# EAGLE design Jacdac_Pressure_Sensor-RevA (EAGLE 9.6.2)
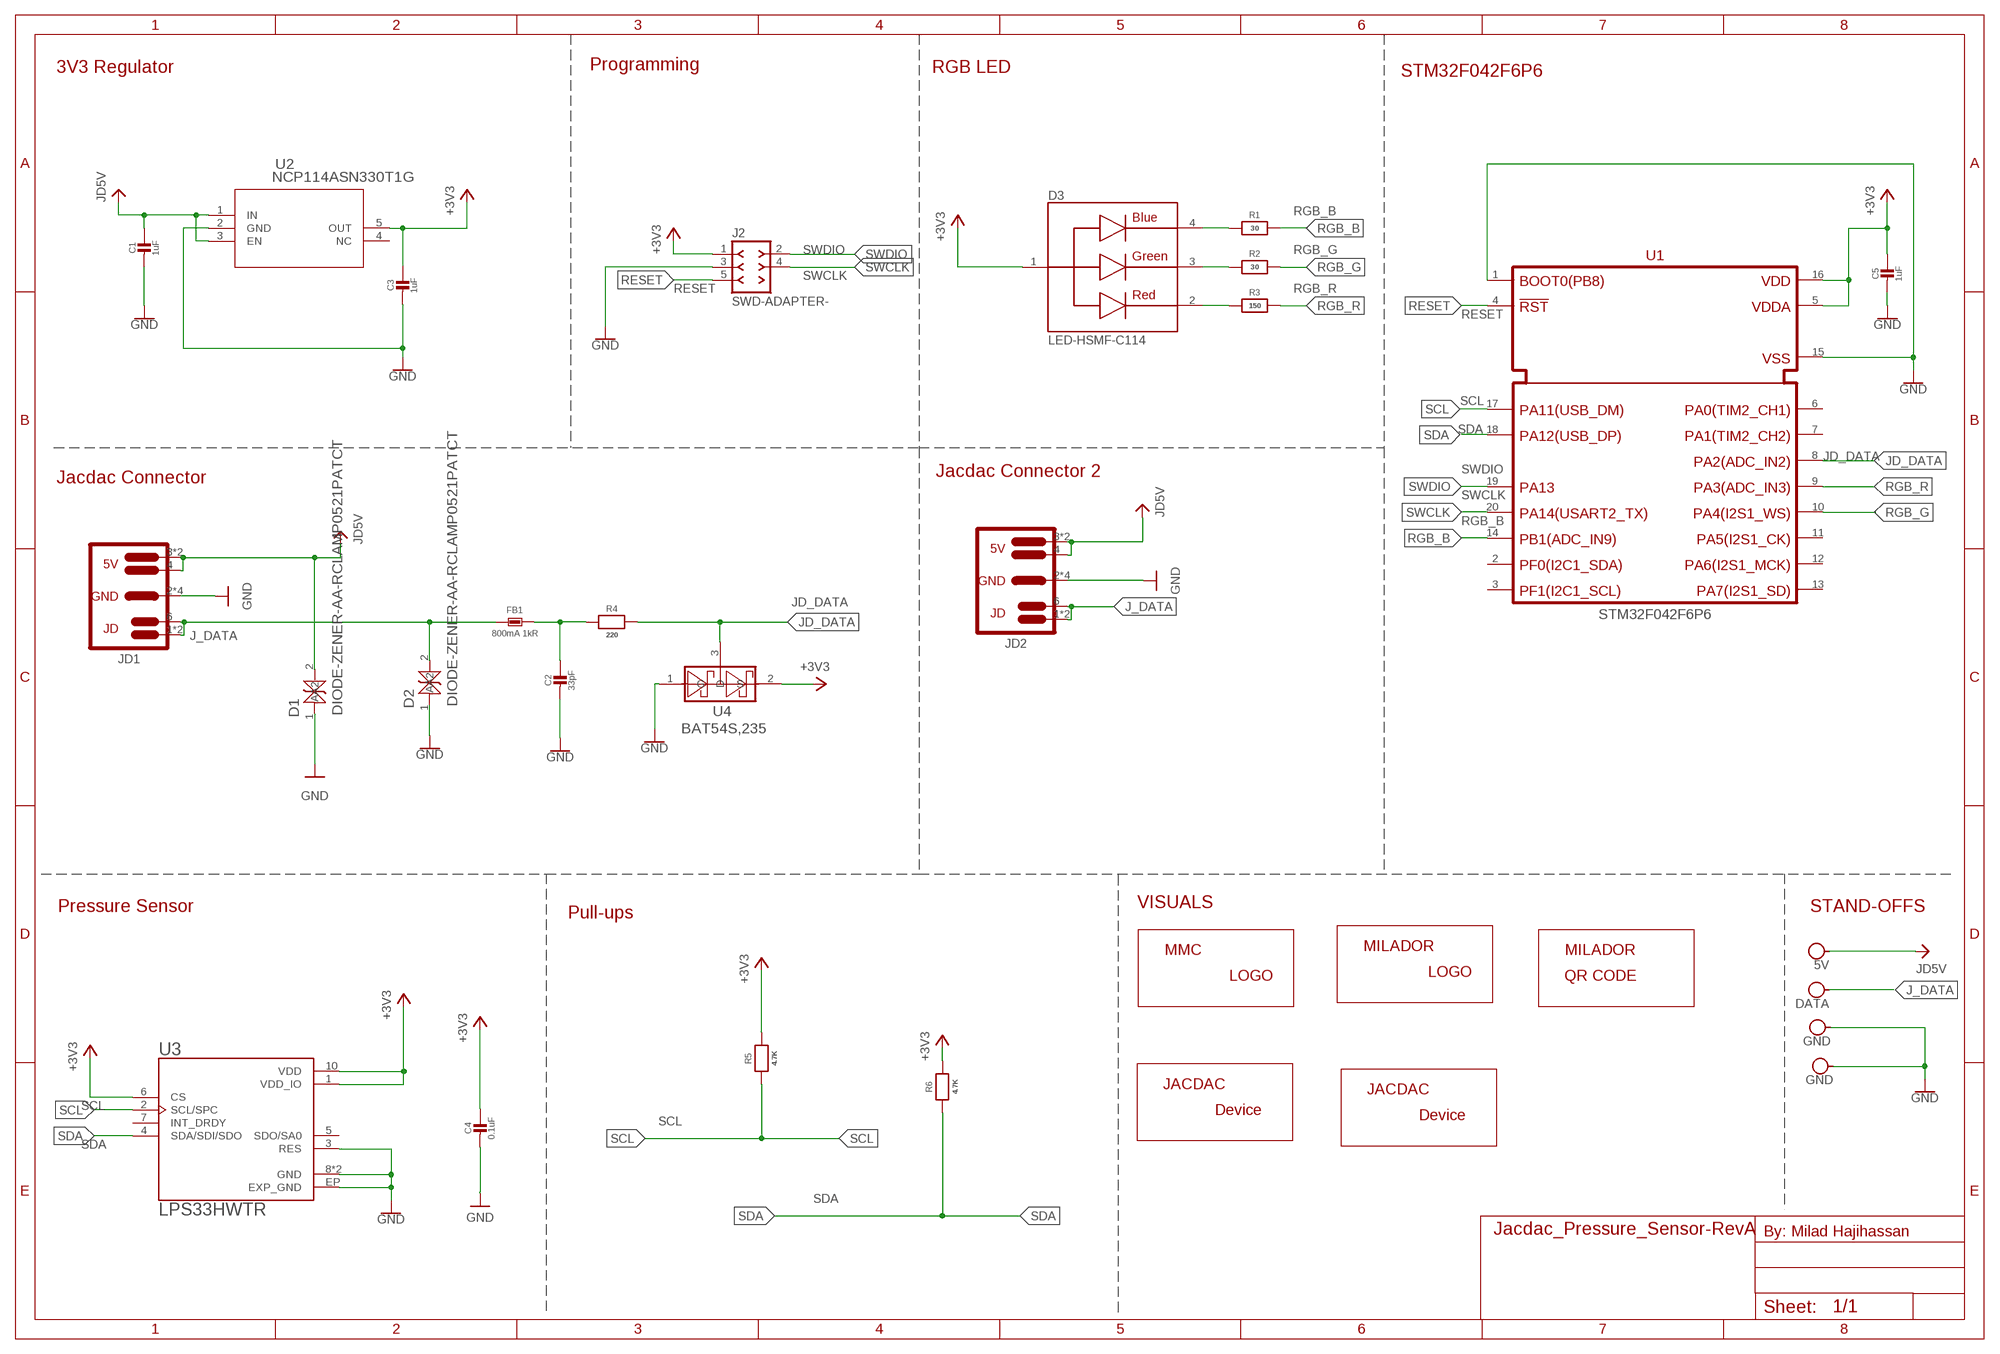
[diagram p0: schematic, sheet 1]

## Parts
C1  1uF  CAP_CERAMIC-0603-NO  [0603-NO]
C2  33pF  CAP_CERAMIC-0603  [0603]
C3  1uF  CAP_CERAMIC-0603-NO  [0603-NO]
C4  0.1uF  CAP_CERAMIC-0603-NO  [0603-NO]
C5  1uF  CAP_CERAMIC-0603  [0603]
D1  DIODE-ZENER-AA-RCLAMP0521PATCT  [DIODE-ZENER-0402]
D2  DIODE-ZENER-AA-RCLAMP0521PATCT  [DIODE-ZENER-0402]
D3  LED-HSMF-C114  [DIOSC160X150X35-4N]
FB1  800mA 1kR  FERRITE-BEAD-0603-NO  [0603-NO]
J2  SWD-ADAPTER-  [SWD-ADAPTER]
J3  5V  JACDAC-M3-PWR-OUTL  [M3-HOLE-PWR-OUTL]
J4  DATA  JACDAC-M3-DATA-NOTCH  [M3-HOLE-DATA-NOTCH]
J5  GND  JACDAC-M3-GND  [M3-HOLE-GND]
J6  GND  JACDAC-M3-GND  [M3-HOLE-GND]
JD1  JACDAC-EDGE-OUTIE  [JD-EDGE-OUTIE]
JD2  JACDAC-EDGE-OUTIE  [JD-EDGE-OUTIE]
LABEL_JACDAC_PS  MILADOR-JACDAC-DEVICE-PS  [JACDAC-PRESSURE-SENSOR]
LABEL_LPS33HW  MILADOR-JACDAC-DEVICE-LPS33HW  [JACDAC-LPS33HW]
LABEL_MILADOR  MILADOR-LOGO-  [MILADOR_LOGO1]
LABEL_QR_CODE  MILADOR-QR-CODE-JACDAC-GITHUB-PS  [MILADOR_QR_JACDAC_PS]
MMC_LOGO  MMC_LOGO-XSM  [MMC_X-SMALL_LOGO]
R1  30  RESISTOR-0603  [0603]
R2  30  RESISTOR-0603  [0603]
R3  150  RESISTOR-0603  [0603]
R4  220  RESISTOR-0603  [0603]
R5  4.7K  RESISTOR-0603  [0603]
R6  4.7K  RESISTOR-0603  [0603]
U1  STM32F042F6P6  [TSSOP20]
U2  NCP114ASN330T1G  [TSOP-5_ONS]
U3  LPS33HWTR  [PQFN60P330X330X290-11N]
U4  BAT54S,235  [SOT23-3]

## Nets
+3V3: C3.1 C4.1 C5.1 D3.1 J2.1(VCC_1) R5.2 R6.2 U1.5(VDDA) U1.16(VDD) U2.5(OUT) U3.1(VDD_IO) U3.6(CS) U3.10(VDD) U4.2(S)
GND: C1.2 C2.2 C3.2 C4.2 C5.2 D1.1(A) D2.1(A) J2.3(GND_3) J5.H J6.H JD1.2 JD1.5 JD1.P$2 JD1.P$4 JD2.2 JD2.5 JD2.P$2 JD2.P$4 U1.1(BOOT0) U1.15(VSS) U2.2(GND) U3.3(RES) U3.8(GND) U3.9(GND) U3.EP(EXP_GND) U4.1(G)
J_DATA: D2.2(A2) FB1.2 J4.H JD1.1 JD1.6 JD1.P$3 JD2.1 JD2.6 JD2.P$3
JD5V: C1.1 D1.2(A2) J3.H JD1.3 JD1.4 JD1.P$1 JD2.3 JD2.4 JD2.P$1 U2.1(IN) U2.3(EN)
JD_DATA: R4.2 U1.8(PA2) U4.3(D)
N$1: D3.4 R1.1
N$2: D3.3 R2.1
N$3: D3.2 R3.1
N$4: C2.1 FB1.1 R4.1
RESET: J2.5(RESET_5) U1.4(!RST)
RGB_B: R1.2 U1.14(PB1)
RGB_G: R2.2 U1.10(PA4)
RGB_R: R3.2 U1.9(PA3)
SCL: R5.1 U1.17(PA11) U3.2(SCL/SPC)
SDA: R6.1 U1.18(PA12) U3.4(SDA/SDI/SDO)
SWCLK: J2.4(SWCLK_4) U1.20(PA14)
SWDIO: J2.2(SWDIO_2) U1.19(PA13)
Unconnected: U1.2(PF0) U1.3(PF1) U1.6(PA0) U1.7(PA1) U1.11(PA5) U1.12(PA6) U1.13(PA7) U2.4(NC) U3.5(SDO/SA0) U3.7(INT_DRDY)

## Notes on the sheet
- 3V3 Regulator | Programming | RGB LED
- STM32F042F6P6
- Jacdac Connector 2
- Jacdac Connector
- Pressure Sensor | VISUALS | STAND-OFFS
- Pull-ups
- By: Milad Hajihassan

## Library data of the parts
C1-C5 = milador_SMD:CAP_CERAMIC-: Ceramic Capacitors For new designs, use the packages preceded by an '_' character since they are more reliable: The following footprints should be used on most boards: _0402 - Standard footprint for regular board layouts _0603 - Standard footprint for regular board layouts _0805 - Standard footprint for regular board layouts _1206 - Standard footprint for regular board layouts For extremely tight-pitch boards where space is at a premium, the following 'micro-pitch' footprints can be used (smaller pads, no silkscreen outline, etc.): _0402MP - Micro-pitch footprint for very dense/compact boards _0603MP - Micro-pitch footprint for very dense/compact boards _0805MP - Micro-pitch footprint for very dense/compact boards _1206MP - Micro-pitch footprint for very dense/compact boards
D1 D2 = milador_SMD:DIODE-ZENER-AA-; COPYRIGHT: Copyright (C) 2021 Ultra Librarian. All rights reserved.; DIGI-KEY_PART_NUMBER_1: RCLAMP0521PACT-ND; DIGI-KEY_PART_NUMBER_2: RCLAMP0521PADKR-ND; DIGI-KEY_PART_NUMBER_3: RCLAMP0521PATR-ND; MANUFACTURER_PART_NUMBER: RCLAMP0521PATCT; MFR_NAME: Semtech
D3 = milador_SMD:LED-HSMF-C114: LED Tri-Color Blue/Green/Red 468nm/523nm/637nm 4-Pin Chip LED T/R Check prices <https://pricing.snapeda.com/parts/HSMF-C114/Broadcom%20Limited/view-part?ref=eda>; DESCRIPTION: Red, Green, Blue (RGB) 626nm Red, 525nm Green, 470nm Blue LED Indication - Discrete 1.9V Red, 3.4V Green, 3.4V Blue 0606 (1616 Metric); MF: Broadcom Limited; MP: HSMF-C114; PACKAGE: 0606 Avago; PRICE: None; PURCHASE-URL: https://pricing.snapeda.com/search/part/HSMF-C114/?ref=eda
FB1 = milador_SMD:FERRITE-BEAD-: Ferrite Beads
J2 = milador:SWD-ADAPTER-
J3-J6 = milador:JACDAC-M3: Jacdac mounting Hole M3
JD1 JD2 = milador:JACDAC-EDGE
LABEL_JACDAC_PS LABEL_LPS33HW = milador:MILADOR-JACDAC-DEVICE-
LABEL_MILADOR = milador:MILADOR-LOGO-
LABEL_QR_CODE = milador:MILADOR-QR-CODE-
MMC_LOGO = MMC Eagle:MMC_LOGO-
R1-R6 = milador_SMD:RESISTOR-: Resistors For new designs, use the packages preceded by an '_' character since they are more reliable: The following footprints should be used on most boards: _0402 - Standard footprint for regular board layouts _0603 - Standard footprint for regular board layouts _0805 - Standard footprint for regular board layouts _1206 - Standard footprint for regular board layouts For extremely tight-pitch boards where space is at a premium, the following 'micro-pitch' footprints can be used (smaller pads, no silkscreen outline, etc.): _0402MP - Micro-pitch footprint for very dense/compact boards _0603MP - Micro-pitch footprint for very dense/compact boards _0805MP - Micro-pitch footprint for very dense/compact boards _1206MP - Micro-pitch footprint for very dense/compact boards
U1 = milador_SMD:STM32F042F6P6; MOUSER: 511-STM32F042F6P6
U2 = milador_SMD:NCP114ASN330T1G; COPYRIGHT: Copyright (C) 2021 Ultra Librarian. All rights reserved.; DIGI-KEY_PART_NUMBER_1: 2156-NCP114ASN330T1G-ND; DIGI-KEY_PART_NUMBER_2: 2156-NCP114ASN330T1G-OS-ND; DIGI-KEY_PART_NUMBER_3: NCP114ASN330T1GOSCT-ND; DIGI-KEY_PART_NUMBER_4: NCP114ASN330T1GOSDKR-ND; DIGI-KEY_PART_NUMBER_5: NCP114ASN330T1GOSTR-ND; MANUFACTURER_PART_NUMBER: NCP114ASN330T1G; MFR_NAME: ON Semiconductor
U3 = milador_SMD:LPS33HWTR: Pressure Sensor; DESCRIPTION: Pressure Sensor 3.77PSI ~ 18.27PSI (26kPa ~ 126kPa) Absolute 24 b LGA; DIGI-KEY_PART_NUMBER: 497-17590-1-ND; MF: STMicroelectronics; MP: LPS33HWTR; PACKAGE: LGA STMicroelectronics
U4 = milador_SMD:BAT54S,235: BAT54S,235 Schottky Diode; DESCRIPTION: N-Channel 50V 200mA (Ta) 300mW (Ta) Surface Mount SOT-23-3; MF: Diodes; MP: BSS138-7-F; PACKAGE: SOT-23-3 Fairchild Semiconductor; PRICE: None; PURCHASE-URL: https://pricing.snapeda.com/search/part/BSS138-7-F/?ref=eda

## Board
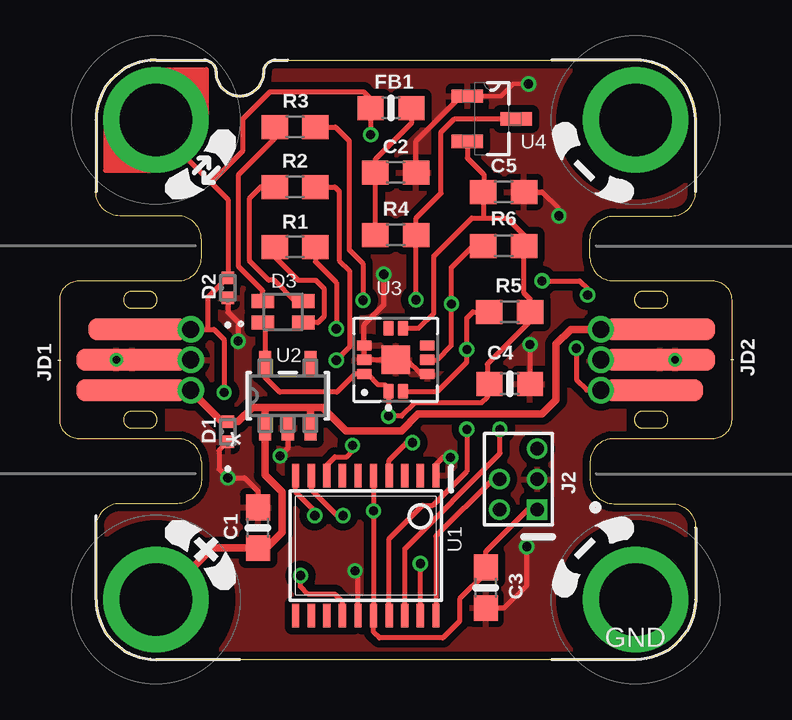
[diagram p1: board, top side]
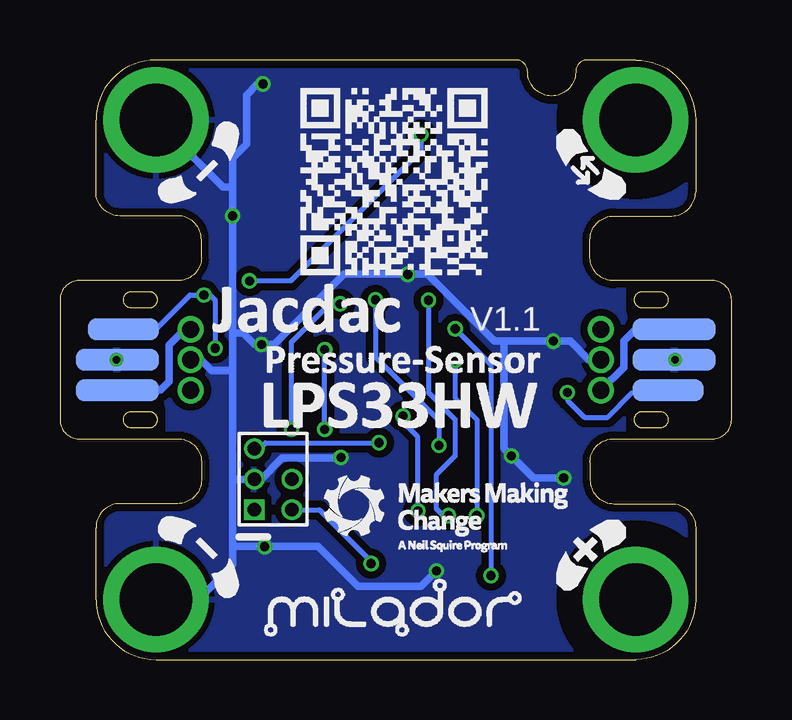
[diagram p2: board, bottom side, seen from below]

Size 28 x 25 mm. Coordinates in mm from the lower left corner, seen from the top.
Outline: 1.5,19.5 1.5,22.5 arc-90 4,25 6,25 arc-90 6.5,24.5 arc90 7.5,23.5 arc90 8.5,24.5 arc-90 9,25 24,25 arc-90 26.5,22.5 26.5,19.5
Outline: 1.5,5.5 1.5,2.5 arc90 4,0 24,0 arc90 26.5,2.5 26.5,5.5
Copper layers (1*16): Top 0.035559375mm / dielectric 1.6mm / Bottom 0.035559375mm
Design rules "SparkFun-2-layer-TIGHT *": minimum track width 5mil, minimum drill 12mil, track to track 5mil, track to pad 5mil, pad to pad 5mil, via to via 5mil, smd to smd 5mil, copper to edge 10mil, drill to drill 8mil, minimum pad ring 5mil, minimum via ring 5mil, stop-mask expansion 2.5mil, vias tented up to drill 30mil, thermal gap 10mil

### Footprints (pad centres in the part's own frame; a part is rotated, then mirrored left to right if it is on the bottom)
0603-NO = smd 1.075 x 1: 1 -0.85,0; 2 0.85,0
0603 = smd 1.1 x 1: 1 -0.85,0; 2 0.85,0
DIODE-ZENER-0402 = smd 0.508 x 0.508: 1 -0.419,0; 2 0.419,0
DIOSC160X150X35-4N = smd 0.94 x 0.57: 1 -0.845,-0.45; 2 -0.845,0.45; 3 0.845,0.45; 4 0.845,-0.45
SWD-ADAPTER = drill 0.559 pad 0.864 square: 1 0,0 | drill 0.559 pad 0.864: 2 0,1.575; 3 1.27,0; 4 1.27,1.575; 5 2.54,0
M3-HOLE-PWR-OUTL = drill 3.03 pad 4.4: H 0,0
M3-HOLE-DATA-NOTCH = drill 3.03 pad 4.4: H 0,0
M3-HOLE-GND = drill 3.03 pad 4.4: H 0,0
JD-EDGE-OUTIE = smd 0.9 x 4.1: 1 1.27,-3.25 | smd 0.9 x 4.6: 2 0,-3; 3 -1.27,-3 | smd 0.9 x 3.45 bottom: 4 1.27,-2.4; 5 0,-2.4 | smd 0.9 x 2.95 bottom: 6 -1.27,-2.65 | drill 0.71 pad 1.1: P$1 -1.27,-5.45; P$2 0,-5.45; P$3 1.27,-5.45 | drill 0.305 pad 0.559: P$4 0,-2.35
TSSOP20 = smd 0.305 x 0.991: 1 -2.925,-2.918; 2 -2.275,-2.918; 3 -1.625,-2.918; 4 -0.975,-2.918; 5 -0.325,-2.918; 6 0.325,-2.918; 7 0.975,-2.918; 8 1.625,-2.918; 9 2.275,-2.918; 10 2.925,-2.918; 11 2.925,2.918; 12 2.275,2.918; 13 1.625,2.918; 14 0.975,2.918; 15 0.325,2.918; 16 -0.325,2.918; 17 -0.975,2.918; 18 -1.625,2.918; 19 -2.275,2.918; 20 -2.925,2.918
TSOP-5_ONS = smd 1.029 x 0.508: 1 -1.34,0.95; 2 -1.34,0; 3 -1.34,-0.95; 4 1.34,-0.95; 5 1.34,0.95
PQFN60P330X330X290-11N = smd 0.63 x 0.45: 1 -1.32,0.3; 2 -1.32,-0.3; 6 1.32,-0.3; 7 1.32,0.3 | smd 0.45 x 0.63: 3 -0.6,-1.32; 4 0,-1.32; 5 0.6,-1.32; 8 0.6,1.32; 9 0,1.32; 10 -0.6,1.32 | smd 1.2 x 1.2: EP 0,0
SOT23-3 = smd 1.321 x 0.559: 1 -1.016,0.94; 2 -1.016,-0.94; 3 1.016,0

### Placement (x,y rotation side)
C1  8.25,5.5 90 top
C2  14,20.3 0 top
C3  17.75,3 270 top
C4  18.75,11.5 0 top
C5  18.5,19.5 0 top
D1  7,9.5 90 top
D2  7,15.5 90 top
D3  9.3,14.5 0 top
FB1  13.8,23 180 top
J2  19.9,6.25 90 top
J3  4,2.5 0 top
J4  4,22.5 0 top
J5  24,22.5 90 top
J6  24,2.5 0 top
JD1  0,12.5 90 top
JD2  28,12.5 270 top
LABEL_JACDAC_PS  14.8,13.8 0 bottom
LABEL_LPS33HW  13.8,10.6 0 bottom
LABEL_MILADOR  14,1 0 bottom
LABEL_QR_CODE  14,16 0 bottom
MMC_LOGO  12,4.5 0 bottom
R1  9.8,17.2 0 top
R2  9.8,19.7 0 top
R3  9.8,22.2 0 top
R4  14,17.7 0 top
R5  18.75,14.5 0 top
R6  18.5,17.25 0 top
U1  12.75,4.75 180 top
U2  9.5,11 90 top
U3  14,12.5 90 top
U4  18,22.55 0 top

### Tracks (layer width: path | path; a pad name or v marks a point on that pad's centre or on a via)
+3V3  (via drill 0.38)
  Top 0.2: U4.2 16.98,20.91 17.68,20.22 17.68,19.53 C5.1 17.65,18.41 | J2.1 19.49,6.25 17.75,4.51 C3.1 17.75,3.61 16.67,2.52 16.67,1.6 15.97,0.9 13.32,0.9 13.07,1.14 U1.16 v13.08,6.2 v13.07,6.2 U1.5 | C4.1 17.82,11.5 | D3.1 8.46,13.93 8.55,13.83 U2.5 8.55,11.77 9.16,11.16 11.55,11.16 12.3,11.9 U3.10 12.84,11.9 13.28,11.45 13.55,11.45 13.7,11.3 U3.1 v13.7,10.15 14.24,10.15 14.79,10.7 17.58,10.7 17.82,10.94 17.82,11.5 | 17.82,11.5 17.82,12.31 19.6,14.1 R5.2 19.6,15.04 19.35,15.29 R6.2 19.35,17.69 18.63,18.41 17.65,18.41 | U3.6 14.96,13.82 15.59,14.45 15.59,16.82 17.17,18.41 17.65,18.41
  Bottom 0.2: v13.7,10.15 13.7,9.9 13.08,9.28 v13.08,6.2
GND  (via drill 0.38)
  Top 0.178: U4.1 18.38,23.49 18.9,24 v19.54,24
  Top 0.2: U1.1 15.68,8.14 15.96,8.43 v16.29,8.43 | v19.6,13.14 C4.2 | 12.68,12.51 U3.8 12.68,13.98 13.5,14.8 v13.5,16.06 | 12.68,12.51 U3.9 | U3.3 15.04,11.9 14.44,12.5 U3.EP 12.69,12.5 12.68,12.51 | U2.2 9.5,8.81 v9.17,8.49 | C5.2 20.09,19.5 20.8,18.79 v20.8,18.5 | C2.2 14.85,21.62 16.72,23.49 U4.1 | C1.2 8.25,7.02 7.7,7.57 v7,7.57 6.63,7.95 6.63,8.71 D1.1 | C3.2 18.52,2.15 19.46,3.09 v19.46,4.71 | v12.3,3.7 12.43,3.58 U1.15 | v7.42,13.27 7.42,14.07 7,14.49 D2.1
  Top 0.305: JD2.P$4 JD2.2 JD2.P$2 | JD1.P$4 JD1.2 JD1.P$2
  Bottom 0.305: JD1.P$2 5.95,12.5 6.72,13.27 v7.42,13.27 9.49,13.27 | 9.49,13.27 9.89,13.27 12.68,16.06 v13.5,16.06 16.15,16.06 19.08,13.14 v19.6,13.14 19.89,13.14 20.36,13.61 20.8,13.61 | v16.29,8.43 16.3,8.43 16.32,8.41 18.73,8.41 19.62,7.52 J2.3 20.75,7.52 20.8,7.57 | 9.49,13.27 9.49,8.81 v9.17,8.49 8.26,7.57 v7,7.57 | 20.8,13.61 v20.8,18.5 20.8,19.69 | 20.8,12.05 20.8,13.61 | JD2.P$2 22.12,12.5 21.67,12.05 20.8,12.05 | v19.54,24 19.75,24 20.22,23.53 20.22,21.49 20.8,20.91 20.8,19.69 | v12.3,3.7 12.95,3.05 15.57,3.05 17.24,4.71 v19.46,4.71 20.79,4.71 20.8,4.69 | 20.8,19.69 21.19,19.69 J5.H | 20.8,4.69 20.8,7.57 | 20.8,7.57 20.8,12.05 | J6.H 22.25,2.5 20.8,3.95 20.8,4.69
  pour Bottom (isolate 0.305): 26.5,25 26.5,0 1.5,0 1.5,25
  pour Top (isolate 0.305): 26.5,25 26.5,0 1.5,0 1.5,25
J_DATA  (via drill 0.38)
  Top 0.2: 6.29,19.88 7,19.17 D2.2 6.99,15.92 6.19,15.12 6.19,13.77 | 6.29,19.88 7.61,21.19 7.61,22.52 8.76,23.67 12.66,23.67 12.95,23.38 FB1.2 v12.95,21.89 | JD2.P$3 21.96,11.23 21.53,11.66 v21.53,12.97 v21.53,12.98 | JD1.P$3 6.19,13.77 | 6.19,13.77 6.42,13.77 6.84,13.35 v6.84,11.14 | v20.1,15.79 21.67,15.79 22,15.46 v22,15.2 | J4.H 4,22.17 6.29,19.88
  Bottom 0.2: JD2.6 24.01,13.77 22.58,15.2 v22,15.2 21.73,15.2 21.53,15 v21.53,12.98 | v6.84,11.14 6.84,10.8 6.14,10.1 5.17,10.1 4.14,11.12 2.75,11.12 JD1.6 | v12.95,21.89 12.95,21.21 18.38,15.79 v20.1,15.79
JD5V
  Top 0.305: 8.55,10.52 8.03,10.52 7.43,9.92 D1.2 6.75,9.92 5.45,11.21 JD1.P$1 JD1.3 | 8.55,10.52 10.38,10.52 | 10.38,10.52 10.95,10.52 11.93,9.54 14.23,9.54 14.94,10.24 20.1,10.24 20.68,10.82 20.68,13.15 21.3,13.77 JD2.P$1 JD2.3 | J3.H 4.21,2.5 6.36,4.65 C1.1 8.61,4.65 9.27,5.3 9.27,6.98 8.55,7.7 U2.1 8.55,10.52 | U2.3 10.45,10.45 10.38,10.52 | 8.55,10.52
  Bottom 0.305: JD2.P$1 22.79,13.77 23.44,13.12 23.44,11.6 23.81,11.23 JD2.4 | JD1.4 4.01,13.77 4.5,13.29 4.5,12.18 JD1.P$1
JD_DATA  (via drill 0.38)
  Top 0.2: U4.3 16.45,22.55 15.89,21.99 15.89,19.45 14.85,18.4 R4.2 v14.84,15 | U1.8 11.12,8.12 11.46,8.46 11.96,8.46 12.2,8.7 v12.2,8.93
  Bottom 0.2: v12.2,8.93 12.2,9.97 14.84,12.62 v14.84,15
N$1
  Top 0.2: R1.1 8.95,16.81 9.94,15.82 10.66,15.82 11,15.47 11,14.29 10.76,14.05 D3.4
N$2
  Top 0.2: D3.3 9.81,14.95 8.94,15.82 8.7,15.82 7.91,16.61 7.91,19.25 8.36,19.7 R2.1
N$3
  Top 0.2: D3.2 8.46,15.38 7.45,16.38 7.45,20.22 8.95,21.72 R3.1
N$4
  Top 0.2: FB1.1 14.65,22.36 13.15,20.86 C2.1 R4.1
RESET  (via drill 0.38)
  Top 0.2: U1.4 13.72,8.31 14.46,9.04 v14.7,9.04
  Bottom 0.2: J2.5 19.68,8.79 19.43,9.04 v14.7,9.04
RGB_B  (via drill 0.38)
  Top 0.2: R1.2 10.65,16.59 11.52,15.71 v11.52,13.79 | U1.14 11.78,2.41 11.46,2.73 10.35,2.73 10.03,3.05 v10.03,3.5
  Bottom 0.2: v11.52,13.79 10.03,12.3 v10.03,3.5
RGB_G  (via drill 0.38)
  Top 0.2: R2.2 11.47,19.7 11.64,19.52 11.64,16.64 12.07,16.21 12.07,13.03 v11.52,12.48 | v11.52,12.48 | v10.62,6 10.62,6.2 9.82,7 U1.10
  Bottom 0.2: v11.52,12.48 11.52,10.91 10.62,10.01 v10.62,6
RGB_R  (via drill 0.38)
  Top 0.2: R3.2 11.48,22.2 12.05,21.63 12.05,17.08 12.63,16.5 v12.63,14.98 | v12.63,14.98 | U1.9 10.47,7.1 11.57,6 v11.8,6
  Bottom 0.2: v12.63,14.98 12.63,11.12 11.52,10.01 11.52,8.49 12.31,7.7 12.31,6.29 12.02,6 v11.8,6
SCL  (via drill 0.38)
  Top 0.2: U1.17 13.72,5.04 15.12,6.43 15.54,6.43 16.96,7.85 v16.96,9.6 | U3.2 15.74,11.18 16.96,12.4 v16.96,12.92 16.96,14.25 17.21,14.5 R5.1 | v16.96,9.6
  Bottom 0.2: v16.96,9.6 v16.96,12.92
SDA  (via drill 0.38)
  Top 0.2: U3.4 15.73,12.5 16.32,13.09 v16.32,14.83 16.32,16.35 17.22,17.25 R6.1 | U1.18 14.38,4.62 18.35,8.6 v18.35,9.6
  Bottom 0.2: v18.35,9.6 18.35,13.24 16.76,14.83 v16.32,14.83
SWCLK
  Top 0.2: U1.20 15.68,5.15 18.04,7.52 J2.4
SWDIO  (via drill 0.38)
  Top 0.2: U1.19 v15.03,4
  Bottom 0.2: J2.2 17.18,6.25 15.03,4.09 v15.03,4

### Text on the board
tPlace: GND
bPlace: V1.1